# Altium schematic sheet main.SchDoc: ESP
size A4; Author: Evžen Šteif; SheetNumber: 1; SheetTotal: 5
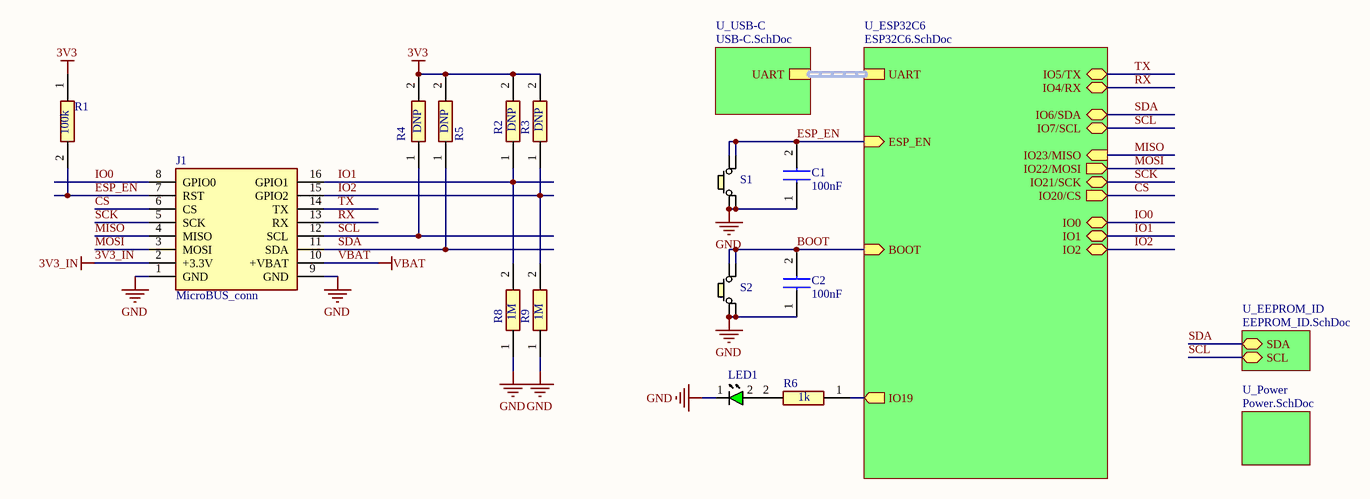
[diagram p0: main.SchDoc]

## Parts
C1  100nF  [CAPC1005X70N]
C2  100nF  [CAPC1005X70N]
J1  MicroBUS_conn  [MicroBUS_header]
LED1  150060GS75000  [LEDC1608X80N]  (value not drawn)
R1  100k  [RESC1005X35N]
R2  DNP  [RESC1005X40N]
R3  DNP  [RESC1005X40N]
R4  DNP  [RESC1005X35N]
R5  DNP  [RESC1005X35N]
R6  1k  [RESC1005X35N]
R8  1M  [RESC1005X40N]
R9  1M  [RESC1005X40N]
S1  KMR731NG_LFS  [KMR731NGLFS]  (value not drawn)
S2  KMR731NG_LFS  [KMR731NGLFS]  (value not drawn)

## Sub-sheets
U_EEPROM_ID = EEPROM_ID.SchDoc: SDA (bidir), SCL (bidir)
U_ESP32C6 = ESP32C6.SchDoc: ESP_EN (in), BOOT (in), IO21/SCK (bidir), IO22/MOSI (out), IO23/MISO (in), IO20/CS (out), IO6/SDA (bidir), IO7/SCL (bidir), IO4/RX (bidir), IO0 (bidir), IO1 (bidir), IO19 (out), UART (harness UART), IO5/TX (bidir), IO2 (bidir)
U_Power = Power.SchDoc: no entries
U_USB-C = USB-C.SchDoc: UART (harness UART)

## Nets
3V3: R1.1 R2.2 R3.2 R4.2 R5.2
3V3_IN: J1.2(+3.3V)
GND: C1.1 C2.1 J1.1(GND) J1.9(GND) LED1.1(K) R8.1 R9.1 S1.1 S1.2 S2.1 S2.2
VBAT: J1.10(+VBAT)
BOOT: C2.2 S2.3 S2.4 ; sheet U_ESP32C6/BOOT
CS: J1.6(CS) ; sheet U_ESP32C6/IO20/CS
ESP_EN: C1.2 J1.7(RST) R1.2 S1.3 S1.4 ; sheet U_ESP32C6/ESP_EN
IO0: J1.8(GPIO0) ; sheet U_ESP32C6/IO0
IO1: J1.16(GPIO1) R2.1 R8.2 ; sheet U_ESP32C6/IO1
IO2: J1.15(GPIO2) R3.1 R9.2 ; sheet U_ESP32C6/IO2
MISO: J1.4(MISO) ; sheet U_ESP32C6/IO23/MISO
MOSI: J1.3(MOSI) ; sheet U_ESP32C6/IO22/MOSI
RX: J1.13(RX) ; sheet U_ESP32C6/IO4/RX
SCK: J1.5(SCK) ; sheet U_ESP32C6/IO21/SCK
SCL: J1.12(SCL) R4.1 ; sheet U_ESP32C6/IO7/SCL, sheet U_EEPROM_ID/SCL
SDA: J1.11(SDA) R5.1 ; sheet U_ESP32C6/IO6/SDA, sheet U_EEPROM_ID/SDA
TX: J1.14(TX) ; sheet U_ESP32C6/IO5/TX
NetLED1_2: LED1.2(A) R6.2
NetR6_1: R6.1 ; sheet U_ESP32C6/IO19

## Buses and harness runs
harness sheet U_ESP32C6/UART = sheet U_USB-C/UART

## Notes on the sheet
- Title:
- Date:
- Project:
- Type:
- Schematic
- Variant:
- Revision:
- Sheet
- of
- Author:
- Evžen Šteif
- Size:
- A4

## Library data of the parts
C1 C2 = GRM155R61A104KA01D: Capacitor; Manufacturer_Name: Murata Electronics; Datasheet Link: https://search.murata.co.jp/Ceramy/image/img/A01X/G101/ENG/GRM155R61A104KA01-02A.pdf; Height: 0.7mm; Manufacturer_Part_Number: GRM155R61A104KA01D; Mouser Part Number: 81-GRM155R61A104KA01; Mouser Price/Stock: https://www.mouser.co.uk/ProductDetail/Murata-Electronics/GRM155R61A104KA01D?qs=5bAuhL3RhmNZw0v59AqOJA%3D%3D; Arrow Part Number: GRM155R61A104KA01D; Arrow Price/Stock: https://www.arrow.com/en/products/grm155r61a104ka01d/murata-manufacturing?utm_currency=USD&region=europe
J1 = MicroBUS_conn: Connector; Manufacturer_Name: Harwin; Manufacturer_Part_Number: M20-9730845; Datasheet Link: https://cdn.harwin.com/pdfs/M20-973.pdf; Height: 9.54mm; Mouser Part Number: 855-M20-9730845; Mouser Price/Stock: https://www.mouser.co.uk/ProductDetail/Harwin/M20-9730845?qs=%252Bk6%2F5FB6qrnRfgIEPS4Dkw%3D%3D
LED1 = 150060GS75000: LED; Manufacturer_Name: Wurth Elektronik; Datasheet Link: https://componentsearchengine.com/Datasheets/2/150060GS75000.pdf; Height: 0.8mm; Manufacturer_Part_Number: 150060GS75000; Mouser Part Number: 710-150060GS75000; Mouser Price/Stock: https://www.mouser.co.uk/ProductDetail/Wurth-Elektronik/150060GS75000?qs=LlUlMxKIyB0UYkq5lDO8nA%3D%3D
R1 = RT0402FRE07100KL: Resistor; Manufacturer_Name: KEMET; Datasheet Link: https://www.yageo.com/upload/media/product/productsearch/datasheet/rchip/PYu-RT_1-to-0.01_RoHS_L_11.pdf; Height: 0.35mm; Manufacturer_Part_Number: RT0402FRE07100KL; Mouser Part Number: 603-RT0402FRE07100KL; Mouser Price/Stock: https://www.mouser.co.uk/ProductDetail/YAGEO/RT0402FRE07100KL?qs=BXCcY9r%252B08CxTvf5JB1kiw%3D%3D; Arrow Part Number: RT0402FRE07100KL; Arrow Price/Stock: https://www.arrow.com/en/products/rt0402fre07100kl/yageo
R2 R3 R8 R9 = RC0402FR-071ML: Resistor; Manufacturer_Name: YAGEO; Datasheet Link: https://componentsearchengine.com/Datasheets/2/RC0402FR-071ML.pdf; Height: 0.4mm; Manufacturer_Part_Number: RC0402FR-071ML; Mouser Part Number: 603-RC0402FR-071ML; Mouser Price/Stock: https://www.mouser.co.uk/ProductDetail/YAGEO/RC0402FR-071ML?qs=V1yeUXFNrknfoI4987wfBQ%3D%3D; Arrow Part Number: RC0402FR-071ML; Arrow Price/Stock: https://www.arrow.com/en/products/rc0402fr-071ml/yageo?region=nac
R4 R5 = RT0402FRE075K1L: Resistor; Manufacturer_Name: YAGEO; Datasheet Link: https://www.yageo.com/upload/media/product/app/datasheet/rchip/pyu-rt_1-to-0.01_rohs_l.pdf; Height: 0.35mm; Manufacturer_Part_Number: RT0402FRE075K1L; Mouser Part Number: RT0402FRE075K1L; Mouser Price/Stock: https://www.mouser.co.uk/ProductDetail/YAGEO/RT0402FRE07100RL?qs=BXCcY9r%252B08AcvLZjF7vcwQ%3D%3D
R6 = RT0402FRE071KL: Resistor; Manufacturer_Name: KEMET; Datasheet Link: https://www.yageo.com/upload/media/product/productsearch/datasheet/rchip/PYu-RT_1-to-0.01_RoHS_L_11.pdf; Height: 0.35mm; Manufacturer_Part_Number: RT0402FRE071KL; Mouser Part Number: RT0402FRE071KL; Mouser Price/Stock: https://www.mouser.co.uk/ProductDetail/YAGEO/RT0402FRE07100KL?qs=BXCcY9r%252B08CxTvf5JB1kiw%3D%3D; Arrow Part Number: RT0402FRE07100KL; Arrow Price/Stock: https://www.arrow.com/en/products/rt0402fre07100kl/yageo
S1 S2 = KMR731NG_LFS: Switch; Manufacturer_Name: C & K COMPONENTS; Manufacturer_Part_Number: KMR731NG LFS; Datasheet Link: https://www.ckswitches.com/media/1908/kmr7.pdf; Mouser Part Number: 611-KMR731NGLFS; Mouser Price/Stock: https://www.mouser.com/Search/Refine.aspx?Keyword=611-KMR731NGLFS; Arrow Part Number: KMR731NG LFS; Arrow Price/Stock: https://www.arrow.com/en/products/kmr731nglfs/ck